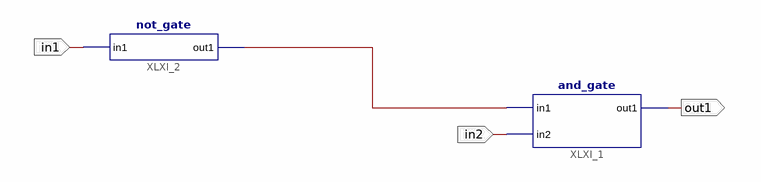
[diagram p0: schematic sheet 1]
// Xilinx ISE schematic top_module_sch.sch (spartan3e) as structural Verilog: 2 symbols, 3 ports
module top_module_sch (
  input  in1,
  input  in2,
  output out1
);

  wire not_and_wire;

  and_gate XLXI_1 (.in1(not_and_wire), .in2(in2), .out1(out1));
  not_gate XLXI_2 (.in1(in1), .out1(not_and_wire));
endmodule
